# EAGLE design Aquarius (EAGLE 6.4)
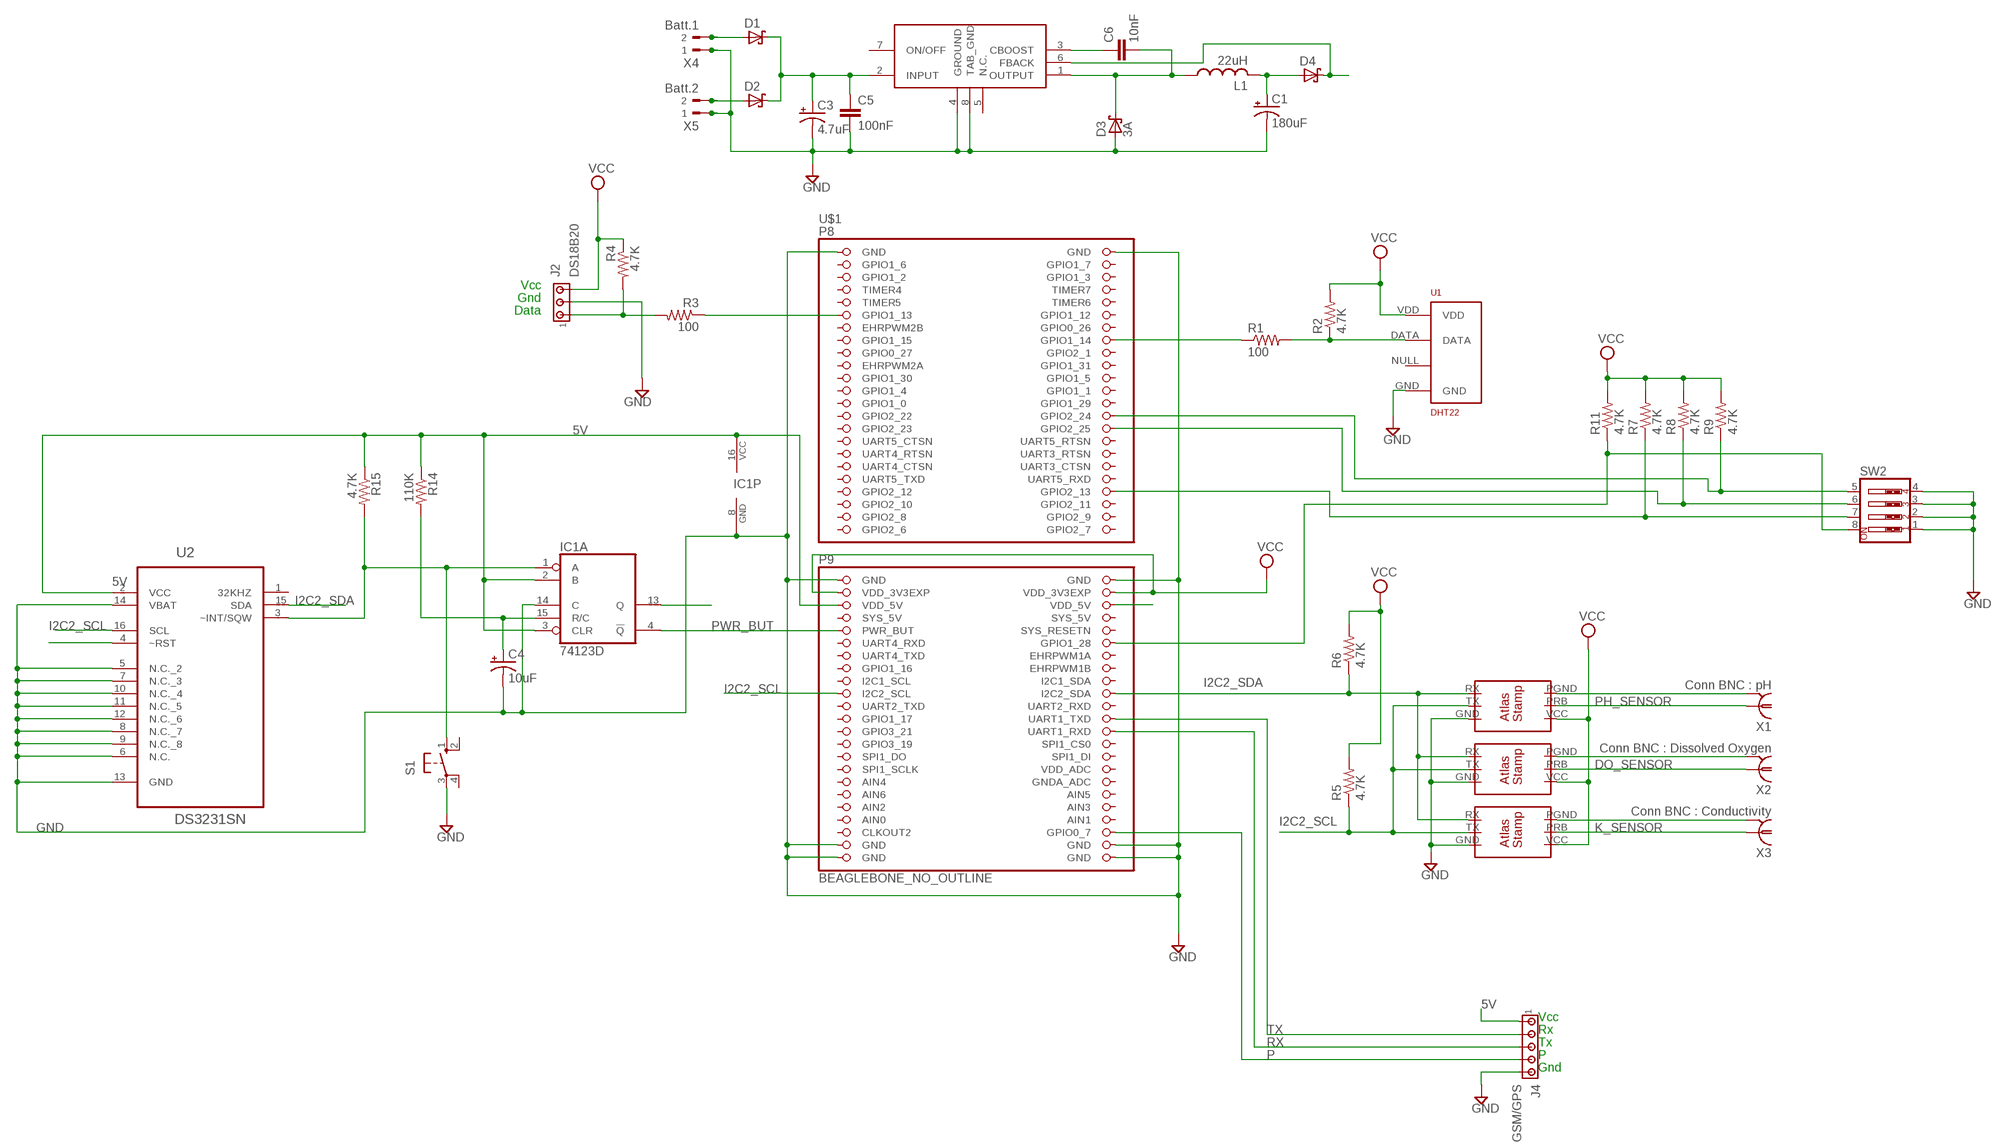
[diagram p0: schematic, sheet 1]

## Parts
C1  180uF  CPOL-US140CLH-0810  [140CLH-0810]
C3  4.7uF  CPOL-US140CLH-0810  [140CLH-0810]
C4  10uF  CPOL-US153CLV-0405  [153CLV-0405]
C5  100nF  C-EUC0805  [C0805]
C6  10nF  C-EUC0805  [C0805]
D1  SCHOTTKY-DIODEDO201T15  [DO201T15]
D2  SCHOTTKY-DIODEDO201T15  [DO201T15]
D3  3A  SCHOTTKY-DIODEDO201T15  [DO201T15]
D4  SCHOTTKY-DIODEDO201T15  [DO201T15]
IC1  74123D  [SO16]
J2  DS18B20  MTA03-100  [10X03MTA]
J4  GSM/GPS  MTA05-100  [10X05MTA]
L1  22uH  L-USL8530M  [L8530M]
LM2678  LM2678KTW0007B  [TO-PMOD7]
R1  100  R-US_R0805  [R0805]
R2  4.7K  R-US_R0805  [R0805]
R3  100  R-US_R0805  [R0805]
R4  4.7K  R-US_R0805  [R0805]
R5  4.7K  R-US_R0805  [R0805]
R6  4.7K  R-US_R0805  [R0805]
R7  4.7K  R-US_R0805  [R0805]
R8  4.7K  R-US_R0805  [R0805]
R9  4.7K  R-US_R0805  [R0805]
R11  4.7K  R-US_R0805  [R0805]
R14  110K  R-US_R0805  [R0805]
R15  4.7K  R-US_R0805  [R0805]
S1  10-XX  [B3F-10XX]
SW2  SW_DIP-4  [EDG-04]
U1  DHT22  RHT03_DHT-22_AM2302WIRED  [AM2302]
U2  DS3231SN  [SOIC127P1032X265-16N]
U$1  BEAGLEBONE_NO_OUTLINE  [BEAGLEBONE_SHIELD_NO_OUTLINE]
U$2  ATLAS_STAMP  [ATLAS_STAMP]
U$3  ATLAS_STAMP  [ATLAS_STAMP]
U$4  ATLAS_STAMP  [ATLAS_STAMP]
X1  Conn BNC : pH  1-227161-0  [AMP_227161]
X2  Conn BNC : Dissolved Oxygen  1-227161-0  [AMP_227161]
X3  Conn BNC : Conductivity  1-227161-0  [AMP_227161]
X4  Batt.1  180G-2  [180G-2]
X5  Batt.2  180G-2  [180G-2]

## Nets
5V: D4.C IC1.2(A:B) IC1.3(A:CLR) IC1.16(P:VCC) J4.1 LM2678.6(FBACK) R14.1 R15.1 U2.2(VCC) U$1.51(VDD_5V) U$1.52(VDD_5V)
DO_SENSOR: U$3.PRB X2.1
GND: C1.- C3.- C4.- C5.2 D3.A IC1.8(P:GND) IC1.14(A:C) J2.2 J4.5 LM2678.4(GROUND) LM2678.8(TAB_GND) S1.3(P) SW2.1 SW2.2 SW2.3 SW2.4 U1.GND U2.5(N.C._2) U2.6(N.C.) U2.7(N.C._3) U2.8(N.C._7) U2.9(N.C._8) U2.10(N.C._4) U2.11(N.C._5) U2.12(N.C._6) U2.13(GND) U2.14(VBAT) U$1.1(GND) U$1.2(GND) U$1.47(GND) U$1.48(GND) U$1.89(GND) U$1.90(GND) U$1.91(GND) U$1.92(GND) U$2.GND U$3.GND U$4.GND X4.1 X5.1
I2C2_SCL: R5.1 U2.16(SCL) U$1.65(I2C2_SCL) U$2.TX U$3.TX U$4.TX
I2C2_SDA: R6.1 U2.15(SDA) U$1.66(I2C2_SDA) U$2.RX U$3.RX U$4.RX
INT: IC1.1(A:A) R15.2 S1.1(S) U2.3(~INT/SQW)
K_SENSOR: U$4.PRB X3.1
N$2: D1.A X4.2
N$3: R1.2 R2.1 U1.DATA
N$4: R3.1 U$1.11(GPIO1_13)
N$5: J2.1 R3.2 R4.2
N$6: R1.1 U$1.16(GPIO1_14)
N$7: R7.1 SW2.7 U$1.40(GPIO2_13)
N$8: D2.A X5.2
N$9: C6.1 LM2678.3(CBOOST)
N$10: C3.+ C5.1 D1.C D2.C LM2678.2(INPUT)
N$11: U$2.PGND X1.2
N$12: U2.4(~RST)
N$13: C6.2 D3.C L1.1 LM2678.1(OUTPUT)
N$14: U$4.PGND X3.2
N$15: U$3.PGND X2.2
N$16: C1.+ D4.A L1.2
N$17: C4.+ IC1.15(A:R/C) R14.2
N$18: R11.1 SW2.8 U$1.58(GPIO1_28)
N$19: R8.1 SW2.6 U$1.30(GPIO2_25)
N$20: IC1.13(A:Q)
N$21: R9.1 SW2.5 U$1.28(GPIO2_24)
P: J4.4 U$1.88(GPIO0_7)
PH_SENSOR: U$2.PRB X1.1
PWR_BUT: IC1.4(A:!Q) U$1.55(PWR_BUT)
RX: J4.3 U$1.72(UART1_RXD)
TX: J4.2 U$1.70(UART1_TXD)
VCC: J2.3 R2.2 R4.1 R5.2 R6.2 R7.2 R8.2 R9.2 R11.2 U1.VDD U$1.49(VDD_3V3EXP) U$1.50(VDD_3V3EXP) U$2.VCC U$3.VCC U$4.VCC
Unconnected: IC1.5(B:Q) IC1.6(B:C) IC1.7(B:R/C) IC1.9(B:A) IC1.10(B:B) IC1.11(B:CLR) IC1.12(B:!Q) LM2678.5(N.C.) LM2678.7(ON/OFF) S1.2(S1) S1.4(P1) U1.NULL U2.1(32KHZ) U$1.3(GPIO1_6) U$1.4(GPIO1_7) U$1.5(GPIO1_2) U$1.6(GPIO1_3) U$1.7(TIMER4) U$1.8(TIMER7) U$1.9(TIMER5) U$1.10(TIMER6) U$1.12(GPIO1_12) U$1.13(EHRPWM2B) U$1.14(GPIO0_26) U$1.15(GPIO1_15) U$1.17(GPIO0_27) U$1.18(GPIO2_1) U$1.19(EHRPWM2A) U$1.20(GPIO1_31) U$1.21(GPIO1_30) U$1.22(GPIO1_5) U$1.23(GPIO1_4) U$1.24(GPIO1_1) U$1.25(GPIO1_0) U$1.26(GPIO1_29) U$1.27(GPIO2_22) U$1.29(GPIO2_23) U$1.31(UART5_CTSN) U$1.32(UART5_RTSN) U$1.33(UART4_RTSN) U$1.34(UART3_RTSN) U$1.35(UART4_CTSN) U$1.36(UART3_CTSN) U$1.37(UART5_TXD) U$1.38(UART5_RXD) U$1.39(GPIO2_12) U$1.41(GPIO2_10) U$1.42(GPIO2_11) U$1.43(GPIO2_8) U$1.44(GPIO2_9) U$1.45(GPIO2_6) U$1.46(GPIO2_7) U$1.54(SYS_5V) U$1.56(SYS_RESETN) U$1.57(UART4_RXD) U$1.59(UART4_TXD) U$1.60(EHRPWM1A) U$1.61(GPIO1_16) U$1.62(EHRPWM1B) U$1.63(I2C1_SCL) U$1.64(I2C1_SDA) U$1.67(UART2_TXD) U$1.68(UART2_RXD) U$1.69(GPIO1_17) U$1.71(GPIO3_21) U$1.73(GPIO3_19) U$1.74(SPI1_CS0) U$1.75(SPI1_DO) U$1.76(SPI1_DI) U$1.77(SPI1_SCLK) U$1.78(VDD_ADC) U$1.79(AIN4) U$1.80(GNDA_ADC) U$1.81(AIN6) U$1.82(AIN5) U$1.83(AIN2) U$1.84(AIN3) U$1.86(AIN1) U$1.87(CLKOUT2)

## Notes on the sheet
- Vcc
- Gnd
- Data
- Vcc
- Rx
- Tx
- P
- Gnd

## Power pins joined to a net without a drawn wire
AIN0: U$1.85(AIN0)
SYS_5V: U$1.53(SYS_5V)

## Library data of the parts
C1 C3 C4 = rcl:CPOL-US: POLARIZED CAPACITOR, American symbol
C5 C6 = rcl:C-EU: CAPACITOR, European symbol
D1-D4 = diode:SCHOTTKY-DIODE: Schottky Diode
IC1 = 74xx-us:74*123: Retriggerable monostable MULTIVIBRATOR
J2 = con-amp:MTA03-100: AMP connector
J4 = con-amp:MTA05-100: AMP connector
L1 = rcl:L-US: INDUCTOR, American symbol
LM2678 = Aquarius:LM2678: LM2678 SIMPLE SWITCHER® High Efficiency 5A Step-Down Voltage Regulator
R1-R9 R11 R14 R15 = adafruit:R-US_: RESISTOR, American symbol
S1 = switch-omron:10-XX: OMRON SWITCH; MPN: B3F-1000; OC_FARNELL: 176432; OC_NEWARK: 36M3542
SW2 = special:SW_DIP-4: DIP SWITCH
U1 = RHT03_DHT-22_AM2302:RHT03_DHT-22_AM2302: RHT03 / DHT-22 / AM2302 Packages and symbol for the RHT03 / DHT-22 relative humidity and temperature sensor. Note: The AM2302 is a wired version of the DHT-22 which typically requires less clearance and is thus provided as a separate package.; PROD_ID: SEN-10167
U2 = Maxim_By_element14_Batch_1:DS3231SN: Extremely Accurate I2C-Integrated RTC/TCXO/Crystal; MPN: DS3231SN#; OC_FARNELL: 1593292; OC_NEWARK: 68K3406; PACKAGE: SOIC-16; SUPPLIER: Maxim
U$1 = LEDscape:BEAGLEBONE_NO_OUTLINE: Should match A3 pinout - but not completely tested
U$2-U$4 = LEDscape:ATLAS_STAMP
X1-X3 = con-coax:?227161*: JACK, RIGHT ANGLE, 50 OHM, PCB, BNC Source: amp_227161.pdf; MF: TYCO ELECTRONICS; MPN: 1-227161; OC_FARNELL: unknown; OC_NEWARK: 33B3200
X4 X5 = con-weidmueller-sl35:180G-2: WEIDMUELLER CLAMP CONNECTOR

## Board
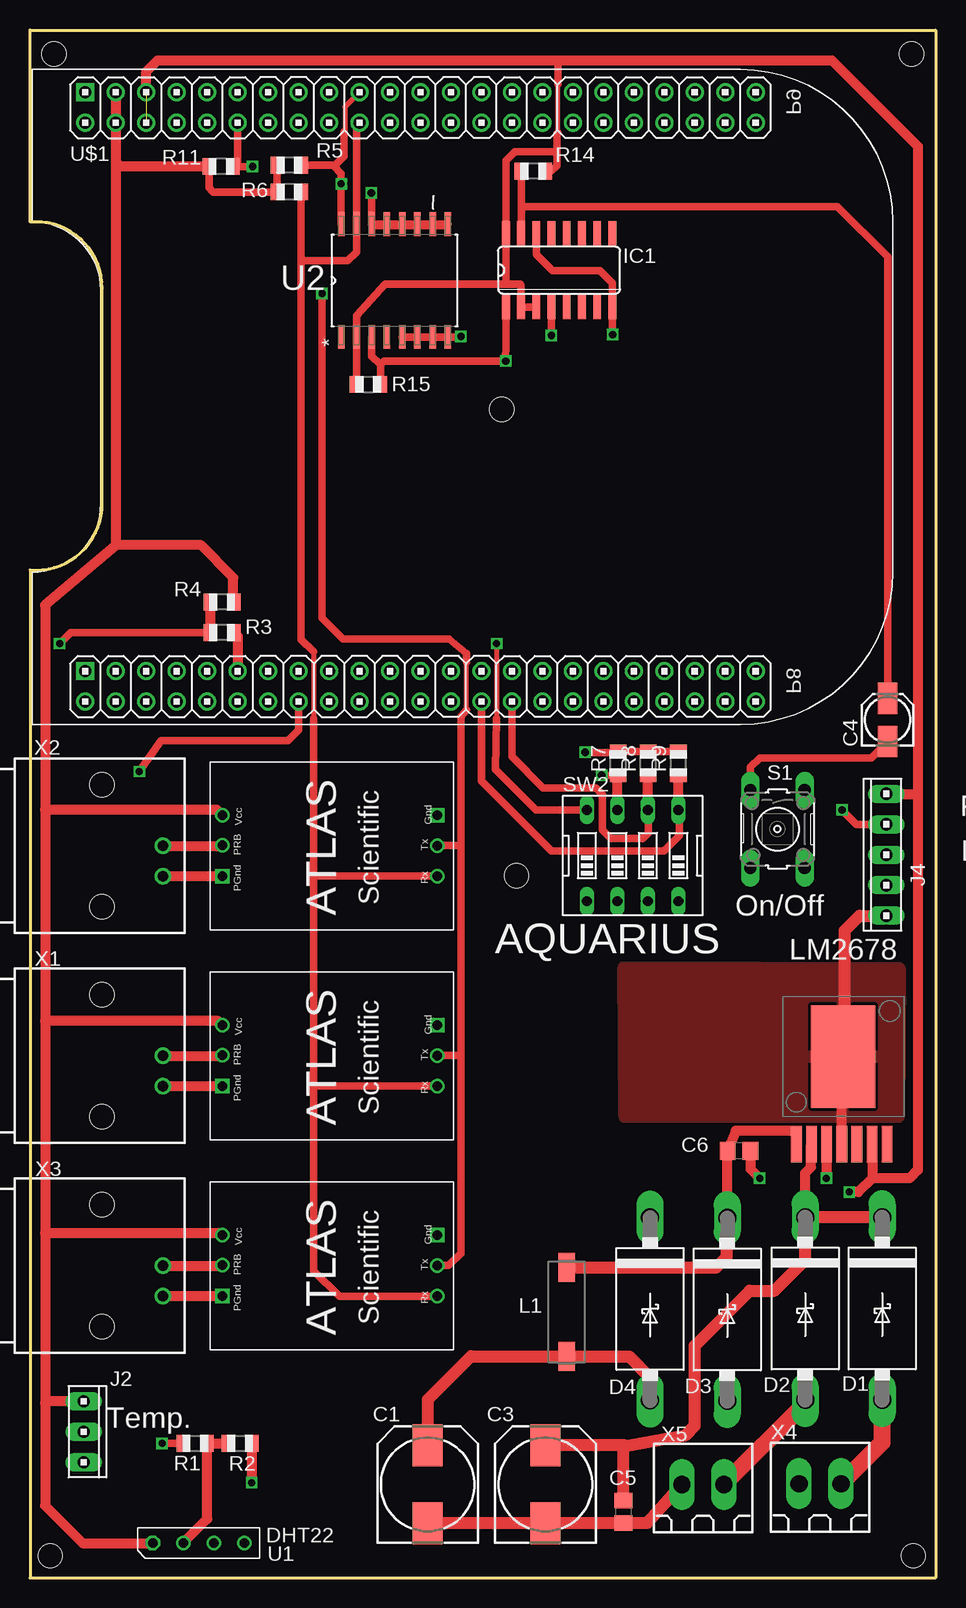
[diagram p1: board, top side]
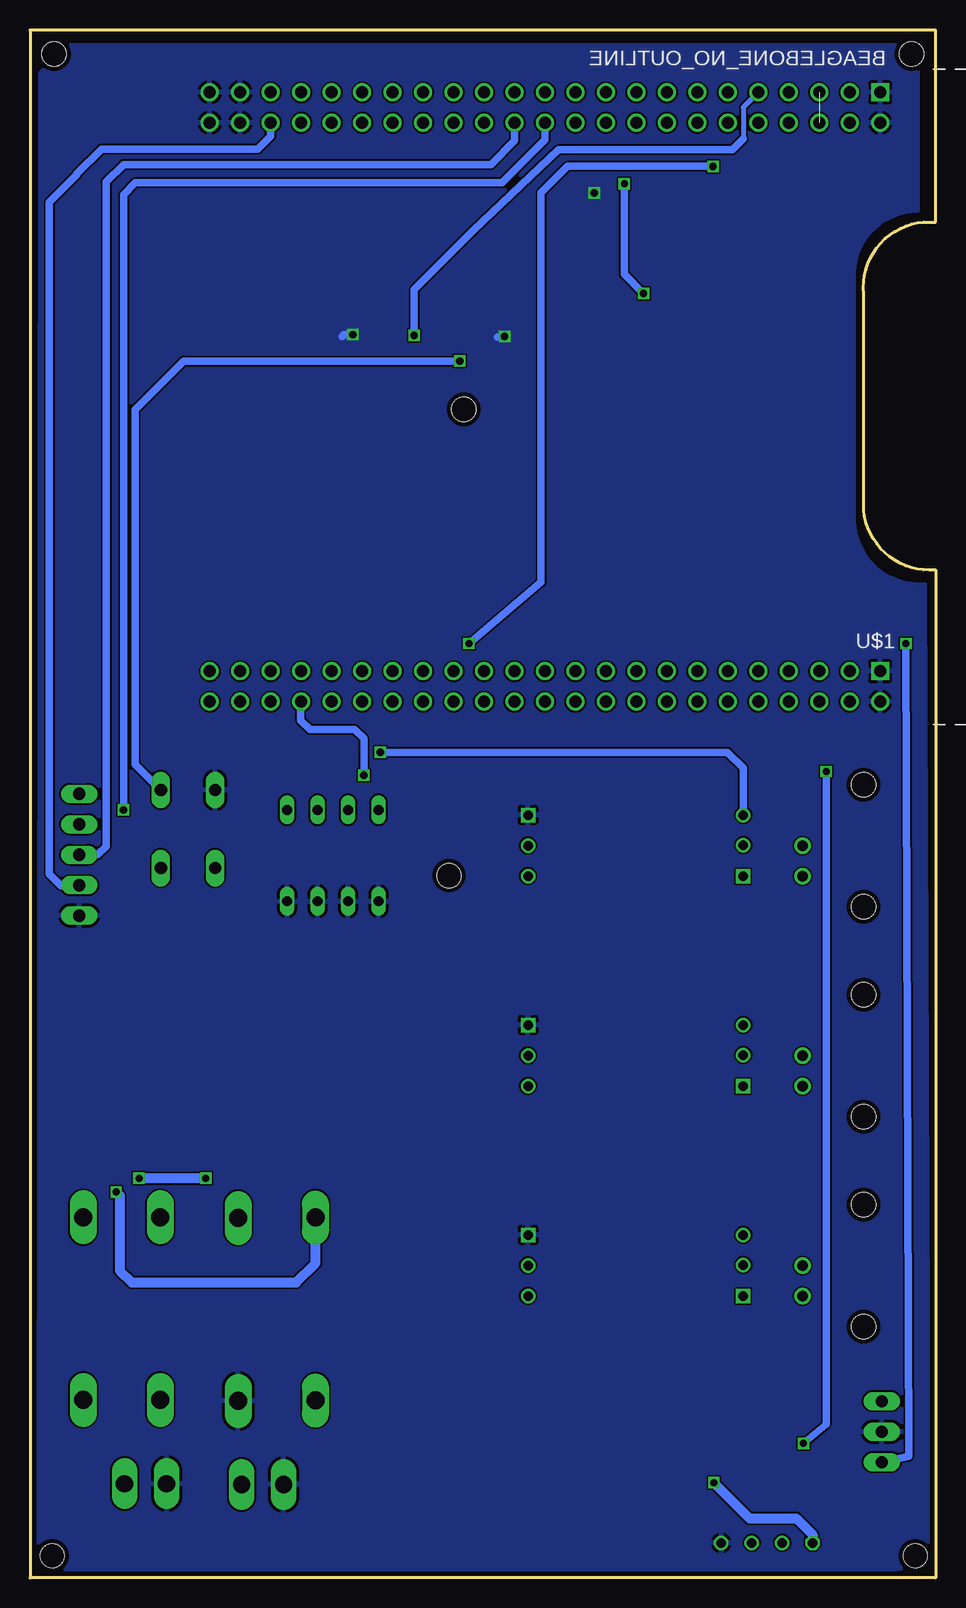
[diagram p2: board, bottom side, seen from below]

Size 75.5 x 129.03 mm. Coordinates in mm from the lower left corner, seen from the top.
Outline: 0,129.03 75.5,129.03 75.5,0 0,0 0,84.03 arc90 6,89.03 6,107.03 arc90 1,113.03 0,113.03 0,129.03
Copper layers (1*16): Top 0.0356mm / dielectric 1.5011mm / Bottom 0.0356mm
Design rules "LaenPCBOrder": minimum track width 6mil, minimum drill 13mil, track to track 6mil, track to pad 6mil, pad to pad 6mil, via to via 6mil, smd to smd 6mil, copper to edge 15mil, drill to drill 6mil, minimum pad ring 7mil, minimum via ring 7mil, stop-mask expansion 3mil, vias tented up to drill 0mil, thermal gap 10mil
Holes 2 mm at 1.7,1.85 73.65,1.85 73.5,127.03 2,127.03 40.56,58.54 39.34,97.4

### Footprints (pad centres in the part's own frame; a part is rotated, then mirrored left to right if it is on the bottom)
140CLH-0810 = smd 3.5 x 2.5: + 3.25,0; - -3.25,0
153CLV-0405 = smd 2.6 x 1.6: + 1.8,0; - -1.8,0
C0805 = smd 1.3 x 1.5: 1 -0.95,0; 2 0.95,0
DO201T15 = drill 1.499 long: A 7.62,0; C -7.62,0
SO16 = smd 0.66 x 2.032: 1 -4.445,-3.073; 2 -3.175,-3.073; 3 -1.905,-3.073; 4 -0.635,-3.073; 5 0.635,-3.073; 6 1.905,-3.073; 7 3.175,-3.073; 8 4.445,-3.073; 9 4.445,3.073; 10 3.175,3.073; 11 1.905,3.073; 12 0.635,3.073; 13 -0.635,3.073; 14 -1.905,3.073; 15 -3.175,3.073; 16 -4.445,3.073
10X03MTA = drill 1.016 long: 1 2.54,0; 2 0,0; 3 -2.54,0
10X05MTA = drill 1.016 long: 1 5.08,0; 2 2.54,0; 3 0,0; 4 -2.54,0; 5 -5.08,0
L8530M = smd 2.4 x 1.4: 1 -3.7,0; 2 3.7,0
TO-PMOD7 = smd 0.89 x 3.06: 1 -3.88,-7.3; 2 -2.62,-7.3; 3 -1.36,-7.3; 4 -0.1,-7.3; 5 1.16,-7.3; 6 2.42,-7.3; 7 3.68,-7.3 | smd 5.35 x 8.54: 8 0.01,0
R0805 = smd 1.1 x 1.4: 1 -1,0; 2 1,0
B3F-10XX = drill 1.016 long: 1 -3.251,2.261; 2 3.251,2.261; 3 -3.251,-2.261; 4 3.251,-2.261
EDG-04 = drill 0.813 long: 1 -3.81,-3.81; 2 -1.27,-3.81; 3 1.27,-3.81; 4 3.81,-3.81; 5 3.81,3.81; 6 1.27,3.81; 7 -1.27,3.81; 8 -3.81,3.81
AM2302 = drill 0.8: DATA -1.27,0; GND 3.81,0; NULL 1.27,0 | drill 0.8 octagon: VDD -3.81,0
SOIC127P1032X265-16N = smd 1.981 x 0.533: 1 -4.699,4.445; 2 -4.699,3.175; 3 -4.699,1.905; 4 -4.699,0.635; 5 -4.699,-0.635; 6 -4.699,-1.905; 7 -4.699,-3.175; 8 -4.699,-4.445; 9 4.699,-4.445; 10 4.699,-3.175; 11 4.699,-1.905; 12 4.699,-0.635; 13 4.699,0.635; 14 4.699,1.905; 15 4.699,3.175; 16 4.699,4.445
BEAGLEBONE_SHIELD_NO_OUTLINE = drill 1 square: 1 4.445,19.05; 47 52.705,19.05 | drill 1: 2 1.905,19.05; 3 4.445,21.59; 4 1.905,21.59; 5 4.445,24.13; 6 1.905,24.13; 7 4.445,26.67; 8 1.905,26.67; 9 4.445,29.21; 10 1.905,29.21; 11 4.445,31.75; 12 1.905,31.75; 13 4.445,34.29; 14 1.905,34.29; 15 4.445,36.83; 16 1.905,36.83; 17 4.445,39.37; 18 1.905,39.37; 19 4.445,41.91; 20 1.905,41.91; 21 4.445,44.45; 22 1.905,44.45; 23 4.445,46.99; 24 1.905,46.99; 25 4.445,49.53; 26 1.905,49.53; 27 4.445,52.07; 28 1.905,52.07; 29 4.445,54.61; 30 1.905,54.61; 31 4.445,57.15; 32 1.905,57.15; 33 4.445,59.69; 34 1.905,59.69; 35 4.445,62.23; 36 1.905,62.23; 37 4.445,64.77; 38 1.905,64.77; 39 4.445,67.31; 40 1.905,67.31; 41 4.445,69.85; 42 1.905,69.85; 43 4.445,72.39; 44 1.905,72.39; 45 4.445,74.93; 46 1.905,74.93; 48 50.165,19.05; 49 52.705,21.59; 50 50.165,21.59; 51 52.705,24.13; 52 50.165,24.13; 53 52.705,26.67; 54 50.165,26.67; 55 52.705,29.21; 56 50.165,29.21; 57 52.705,31.75; 58 50.165,31.75; 59 52.705,34.29; 60 50.165,34.29; 61 52.705,36.83; 62 50.165,36.83; 63 52.705,39.37; 64 50.165,39.37; 65 52.705,41.91; 66 50.165,41.91; 67 52.705,44.45; 68 50.165,44.45; 69 52.705,46.99; 70 50.165,46.99; 71 52.705,49.53; 72 50.165,49.53; 73 52.705,52.07; 74 50.165,52.07; 75 52.705,54.61; 76 50.165,54.61; 77 52.705,57.15; 78 50.165,57.15; 79 52.705,59.69; 80 50.165,59.69; 81 52.705,62.23; 82 50.165,62.23; 83 52.705,64.77; 84 50.165,64.77; 85 52.705,67.31; 86 50.165,67.31; 87 52.705,69.85; 88 50.165,69.85; 89 52.705,72.39; 90 50.165,72.39; 91 52.705,74.93; 92 50.165,74.93
ATLAS_STAMP = drill 0.8 square: GND 4.445,18.97; PGND 9.525,1.03 | drill 0.8: PRB 6.95,1.03; RX 9.525,18.97; TX 6.985,18.97; VCC 4.445,1.03
AMP_227161 = drill 0.9 pad 1.27: 1 0,-5.08; 2 -2.54,-5.08 | hole 2: -5.08,0; 5.08,0
180G-2 = drill 1.422 long: 1 -1.75,0; 2 1.75,0

### Placement (x,y rotation side)
C1  33.16,7.8 90 top
C3  42.97,7.8 90 top
C4  71.5,71.53 90 top
C5  49.46,5.51 270 top
C6  59.12,35.61 180 top
D1  71.05,22.45 270 top
D2  64.63,22.45 270 top
D3  58.13,22.38 270 top
D4  51.7,22.41 270 top
DRILEGEND  [DRILEGEND]  -0.02,-6.35 0 top  (outside the outline)
IC1  44.11,109.02 0 top
J2  4.48,12.18 270 top
J4  71.39,60.28 90 top
L1  44.74,22.18 270 top
LM2678  67.78,43.46 0 top
R1  13.78,11.21 0 top
R2  17.51,11.22 0 top
R3  16.01,78.81 180 top
R4  16.01,81.34 180 top
R5  21.62,117.75 180 top
R6  21.62,115.53 180 top
R7  49.03,67.91 90 top
R8  51.55,67.91 90 top
R9  54.06,67.91 90 top
R11  15.94,117.65 180 top
R14  41.97,117.25 180 top
R15  28.21,99.48 0 top
S1  62.33,62.42 270 top
SW2  50.25,60.21 0 top
U1  14.06,2.92 0 top
U2  30.4,108.15 90 top
U$1  -14.43,71.13 90 bottom
U$2  15,50.53 270 top
U$3  15,68.03 270 top
U$4  15,33.03 270 top
X1  6,43.53 90 top
X2  6,61.03 90 top
X3  6,26.03 90 top
X4  65.87,7.86 0 top
X5  56.12,7.78 0 top

### Tracks (layer width: path | path; a pad name or v marks a point on that pad's centre or on a via)
5V  (via drill 0.6)  (1 unrouted)
  Top 0.406: 44.01,120.48 44.01,124.52
  Top 0.61: R14.1 43.44,117.25 43.93,117.74 43.93,118.96 | 43.93,118.96 43.93,120.41 44.01,120.48 | 44.01,124.52 44.01,126.5 | 43.93,118.96 43.85,118.88 40.42,118.88 39.67,118.13 IC1.16 39.67,107.99 39.66,107.83 | R15.1 U2.2 27.22,105.22 29.6,107.83 39.66,107.83 | 39.66,107.83 40.88,107.83 40.96,107.76 40.96,105.96 IC1.2 IC1.3
  Top 0.813: LM2678.6 70.22,36.14 70.22,33.31 | 70.22,33.31 69.08,32.17 v68.31,32.17 | U$1.51 9.7,125.57 10.63,126.5 44.01,126.5 66.86,126.5 74.03,119.34 74.03,65.47 | 74.03,65.47 74.03,34 73.34,33.31 70.22,33.31 | J4.1 73.92,65.36 74.03,65.47
  Bottom 0.813: v68.31,32.17 68.01,31.86 68.01,25.61 67.02,24.62 53.3,24.62 51.7,26.22 D4.C
DO_SENSOR
  Top 0.813: X2.1 15.98,61.03 U$3.PRB
GND  (via drill 0.6)
  Top 0.61: IC1.14 42.21,110.32 43.55,108.98 47.51,108.98 48.58,107.91 48.58,105.96 IC1.8 48.56,103.66 v48.58,103.64 | U2.5 U2.6 U2.7 | U2.7 U2.8 | U2.7 35.89,103.45 v35.93,103.49 | U2.14 U2.13 U2.12 U2.11 U2.10 U2.9 34.7,112.71 28.61,112.71 28.46,112.86 v28.46,115.45 | C4.- 70.13,68.36 60.84,68.36 60.07,67.59 S1.3
  Top 0.813: LM2678.4 67.68,43.35 LM2678.8
  Top 1.016: X5.1 51.45,4.56 C5.2 49.45,4.55 C3.- C1.- | LM2678.8 arc90 67.93,43.6 67.93,53.96 69.15,55.18 71.37,55.18 J4.5
  Bottom 0.61: v48.58,103.64 49.34,103.64 49.49,103.49 | v35.93,103.49 36.46,103.49 36.54,103.41
  pour Bottom: 1.49,114.01 1.49,125.59 3.16,127.72 72.5,127.72 74.64,125.44 74.79,0.77 3.31,0.77 0.57,1.08 0.88,82.76 1.33,82.76 arc90 6.82,88.25 6.82,108.67 arc90
  pour Top: 49.49,50.91 72.5,50.84 72.43,38.42 49.57,38.42
I2C2_SCL  (via drill 0.6)
  Top 0.406: 36.38,72.32 36.38,76.36 | U$1.65 26.25,122.62 26.25,120.64 26.17,120.56
  Top 0.61: U$4.TX 34.91,26.05 35.93,27.06 35.93,43.44 | 35.93,43.44 35.93,60.97 | 35.93,60.97 35.93,61.05 | 35.93,61.05 U$3.TX | U$3.TX | U$2.TX 35.83,43.55 35.93,43.44 | U$3.TX 35.77,61.05 35.93,60.97 | 35.93,61.05 35.93,71.79 36.38,72.32 | 36.38,76.36 36.38,77.05 34.94,78.27 26.1,78.27 24.35,80.02 v24.35,107.07 | U2.16 v25.95,116.21 v25.95,116.22 25.95,117.05 25.34,117.66 | R5.1 25.24,117.75 25.34,117.66 | 26.17,120.56 26.17,118.5 25.34,117.66
  Bottom 0.61: v24.35,107.07 25.95,108.67 v25.95,116.22
I2C2_SDA
  Top 0.406: 23.66,77.2 23.66,71.64
  Top 0.61: 22.62,109.79 22.62,78.24 23.66,77.2 | 23.66,71.64 23.66,58.53 | 23.66,58.53 23.66,40.93 | 23.66,40.93 23.66,25.61 25.79,23.48 33.94,23.48 U$4.RX | R6.1 22.62,109.79 | 22.62,109.79 26.48,109.82 27.24,110.5 27.24,112.83 U2.15 27.22,121.04 U$1.66 | U$3.RX 23.68,58.51 23.66,58.53 | U$2.RX 23.74,41.01 23.66,40.93
INT  (via drill 0.6)
  Top 0.61: U2.3 28.49,101.86 29.22,101.13 | 29.22,101.13 29.22,99.49 R15.2 | IC1.1 39.67,102.95 v39.66,101.43 29.53,101.43 29.22,101.13
  Bottom 0.61: S1.1 66.71,67.79 66.71,97.39 62.67,101.43 v39.66,101.43
K_SENSOR
  Top 0.813: X3.1 15.98,26.03 U$4.PRB
N$2
  Top 1.422: X4.2 71.05,11.29 D1.A
N$3
  Top 0.813: R2.1 14.85,11.22 R1.2 14.78,4.91 U1.DATA
N$4
  Top 0.813: R3.1 17.32,78.51 U$1.11
N$5  (via drill 0.6)
  Top 0.61: R3.2 3.4,78.81 v2.48,77.89
  Top 0.813: R4.2 R3.2
  Bottom 0.61: v2.48,77.89 2.25,10.13 J2.1
N$6  (via drill 0.6)
  Top 0.61: U$1.16 22.4,70.68 21.53,69.81 10.93,69.81 v9.11,67.22 | v11.01,11.21 R1.1
  Bottom 0.61: v9.11,67.22 9.11,12.81 v11.01,11.21
N$7  (via drill 0.6)
  Top 0.61: R7.1 47.67,66.91 v47.66,66.91
  Top 0.813: SW2.7 48.98,66.85 R7.1
  Bottom 0.61: v47.66,66.91 47.66,69.96 48.42,70.72 52.16,70.72 52.92,71.49 52.92,73 U$1.40
N$8
  Top 1.422: X5.2 64.63,14.55 D2.A
N$9  (via drill 0.6)
  Top 0.813: C6.1 60.07,34.09 v60.84,33.31 | v66.41,33.31 66.42,33.86 LM2678.3
  Bottom 0.813: v60.84,33.31 v66.41,33.31
N$10
  Top 0.813: D2.C 64.63,33.75 65.11,34.22 65.11,36.11 LM2678.2
  Top 1.016: 49.49,10.98 49.49,11.06 47.07,11.05 C3.+ | C5.1 49.49,6.49 49.49,10.98 | 49.49,10.98 52.92,11.59 54.67,11.9 55.44,12.66 55.44,19.37 60.01,23.94 62.06,23.94 64.63,26.51 D2.C D1.C
N$11
  Top 0.813: X1.2 16.02,40.99 U$2.PGND
N$13
  Top 0.813: LM2678.1 63.9,37.27 63.89,37.27 58.84,37.27 C6.2 58.13,35.57 D3.C
  Top 1.016: L1.1 57.22,25.88 58.1,26.76 58.1,29.97 D3.C
N$14
  Top 0.813: X3.2 16.02,23.49 U$4.PGND
N$15
  Top 0.813: X2.2 16.02,58.49 U$3.PGND
N$16
  Top 1.016: C1.+ 33.19,11.07 33.19,14.87 36.79,18.48 L1.2 44.77,18.45 49.95,18.45 51.7,16.7 D4.A
N$17
  Top 0.61: R14.2 40.97,114.39 | 40.97,114.39 40.97,112.12 IC1.15 | C4.+ 71.5,110.13 67.32,114.31 41.04,114.31 40.97,114.39
N$18  (via drill 0.6)
  Top 0.406: v38.9,77.89 38.9,71.64
  Top 0.61: U$1.58 17.32,118.03 R11.1 18.54,117.65 v18.55,117.66 | SW2.8 42.18,64.02 38.82,67.37 38.9,71.64
  Bottom 0.61: v18.55,117.66 30.67,117.66 32.88,115.45 32.88,82.99 v38.9,77.89
N$19
  Top 0.61: U$1.30 40.18,68.45 42.79,65.85 47.21,65.85 47.74,65.31 47.74,62.34 48.42,61.66 51.09,61.66 51.55,62.11 51.55,63.99 SW2.6
  Top 0.813: SW2.6 51.52,66.88 R8.1
N$21
  Top 0.61: U$1.28 37.64,66.42 43.47,60.59 52.84,60.59 54.14,61.89 54.14,63.94 SW2.5
  Top 0.813: SW2.5 R9.1
P
  Bottom 0.61: U$1.88 55.42,120.19 56.5,119.11 69.53,119.11 71.59,117.05 71.59,116.98 73.88,114.69 73.88,58.68 72.88,57.69 71.44,57.69 J4.4
PH_SENSOR
  Top 0.813: X1.1 15.98,43.53 U$2.PRB
PWR_BUT  (via drill 0.6)
  Top 0.61: v43.47,103.57 43.48,103.57 IC1.4
  Bottom 0.406: U$1.55 16.04,122.58 16.04,119.95
  Bottom 0.61: 16.04,119.95 16.95,119.04 31.43,119.04 38.52,112.33 43.47,107.38 v43.47,103.57
RX
  Bottom 0.61: U$1.72 35.1,119.79 37.07,117.82 67.7,117.82 69.15,116.37 69.15,60.97 69.84,60.29 J4.3
TX  (via drill 0.6)
  Top 0.61: v67.7,64.02 68.9,62.82 J4.2
  Bottom 0.61: U$1.70 32.56,119.89 36.16,116.29 66.71,116.29 67.7,115.3 v67.7,64.02
VCC  (via drill 0.6)
  Top 0.61: R11.2 14.94,115.87 15.28,115.53 R6.2 R5.2 | v46.29,68.82 48.95,68.82 R7.2 R8.2 R9.2
  Top 0.813: R2.2 18.48,11.18 v18.48,7.94 | U$1.49 U$1.50 7.16,118.04 | 7.16,118.04 7.16,86.08 | 1.26,64.02 1.26,81.09 7.08,86 7.16,86.08 | 1.26,64.02 1.26,46.42 | 1.26,46.42 1.26,28.74 | 1.26,28.74 1.26,14.57 | 1.26,14.57 1.26,6.03 4.38,2.91 10.23,2.91 U1.VDD | J2.3 1.42,14.72 1.26,14.57 | R4.1 16.95,81.4 16.95,83.37 14.25,86.08 7.16,86.08 | U$4.VCC 15.88,28.74 1.26,28.74 | U$2.VCC 15.7,46.42 1.26,46.42 | U$3.VCC 15.6,64.02 1.26,64.02 | R11.2 7.55,117.65 7.16,118.04
  Bottom 0.61: U$3.VCC 16.03,67.51 17.34,68.82 v46.29,68.82
  Bottom 0.813: v18.48,7.94 15.51,4.96 11.62,4.96 10.25,3.59 U1.VDD

### Text on the board
tPlace: AQUARIUS
tNames: Field | Lab | On/Off | LM2678 | Temp.
DrillLegend: LAYER-STACK
DrillLegend_01-16: 01-16
DrillLegend_01-20: 01-20